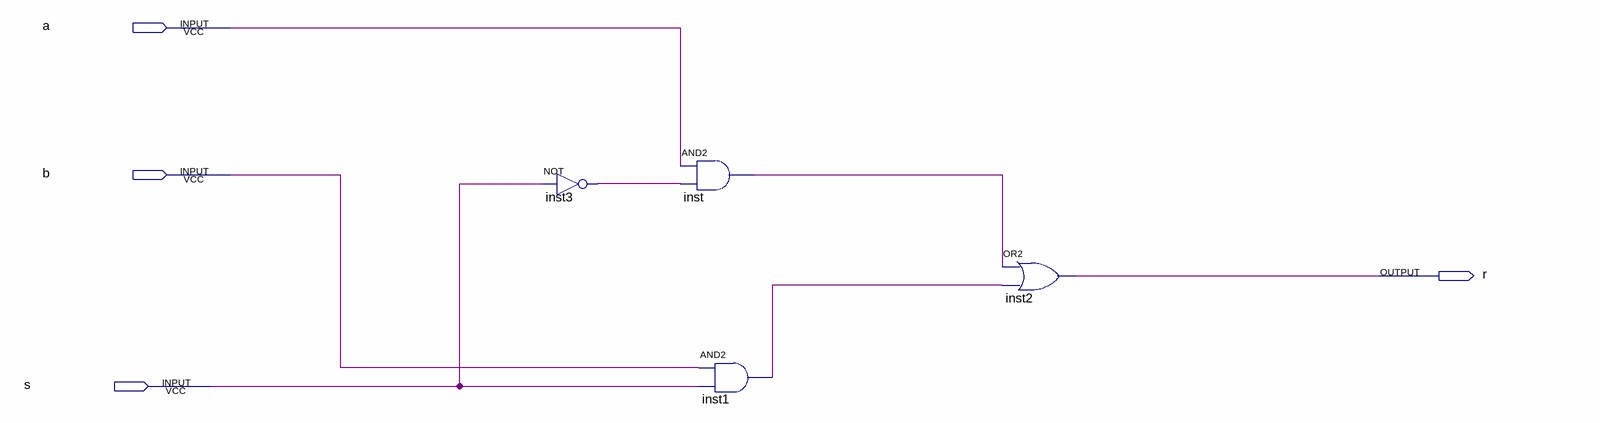
[diagram p0: schematic sheet]
// Quartus schematic mux_2.bdf as structural Verilog: 4 symbols, 4 pins
module mux_2 (
  input  a,
  input  b,
  input  s,
  output r
);

  wire inst1_out, inst3_out, inst_out;

  not inst3 (inst3_out, s);
  and inst (inst_out, a, inst3_out);
  and inst1 (inst1_out, b, s);
  or inst2 (r, inst_out, inst1_out);
endmodule
